# EAGLE design mbmc_io (EAGLE 9.6.2)
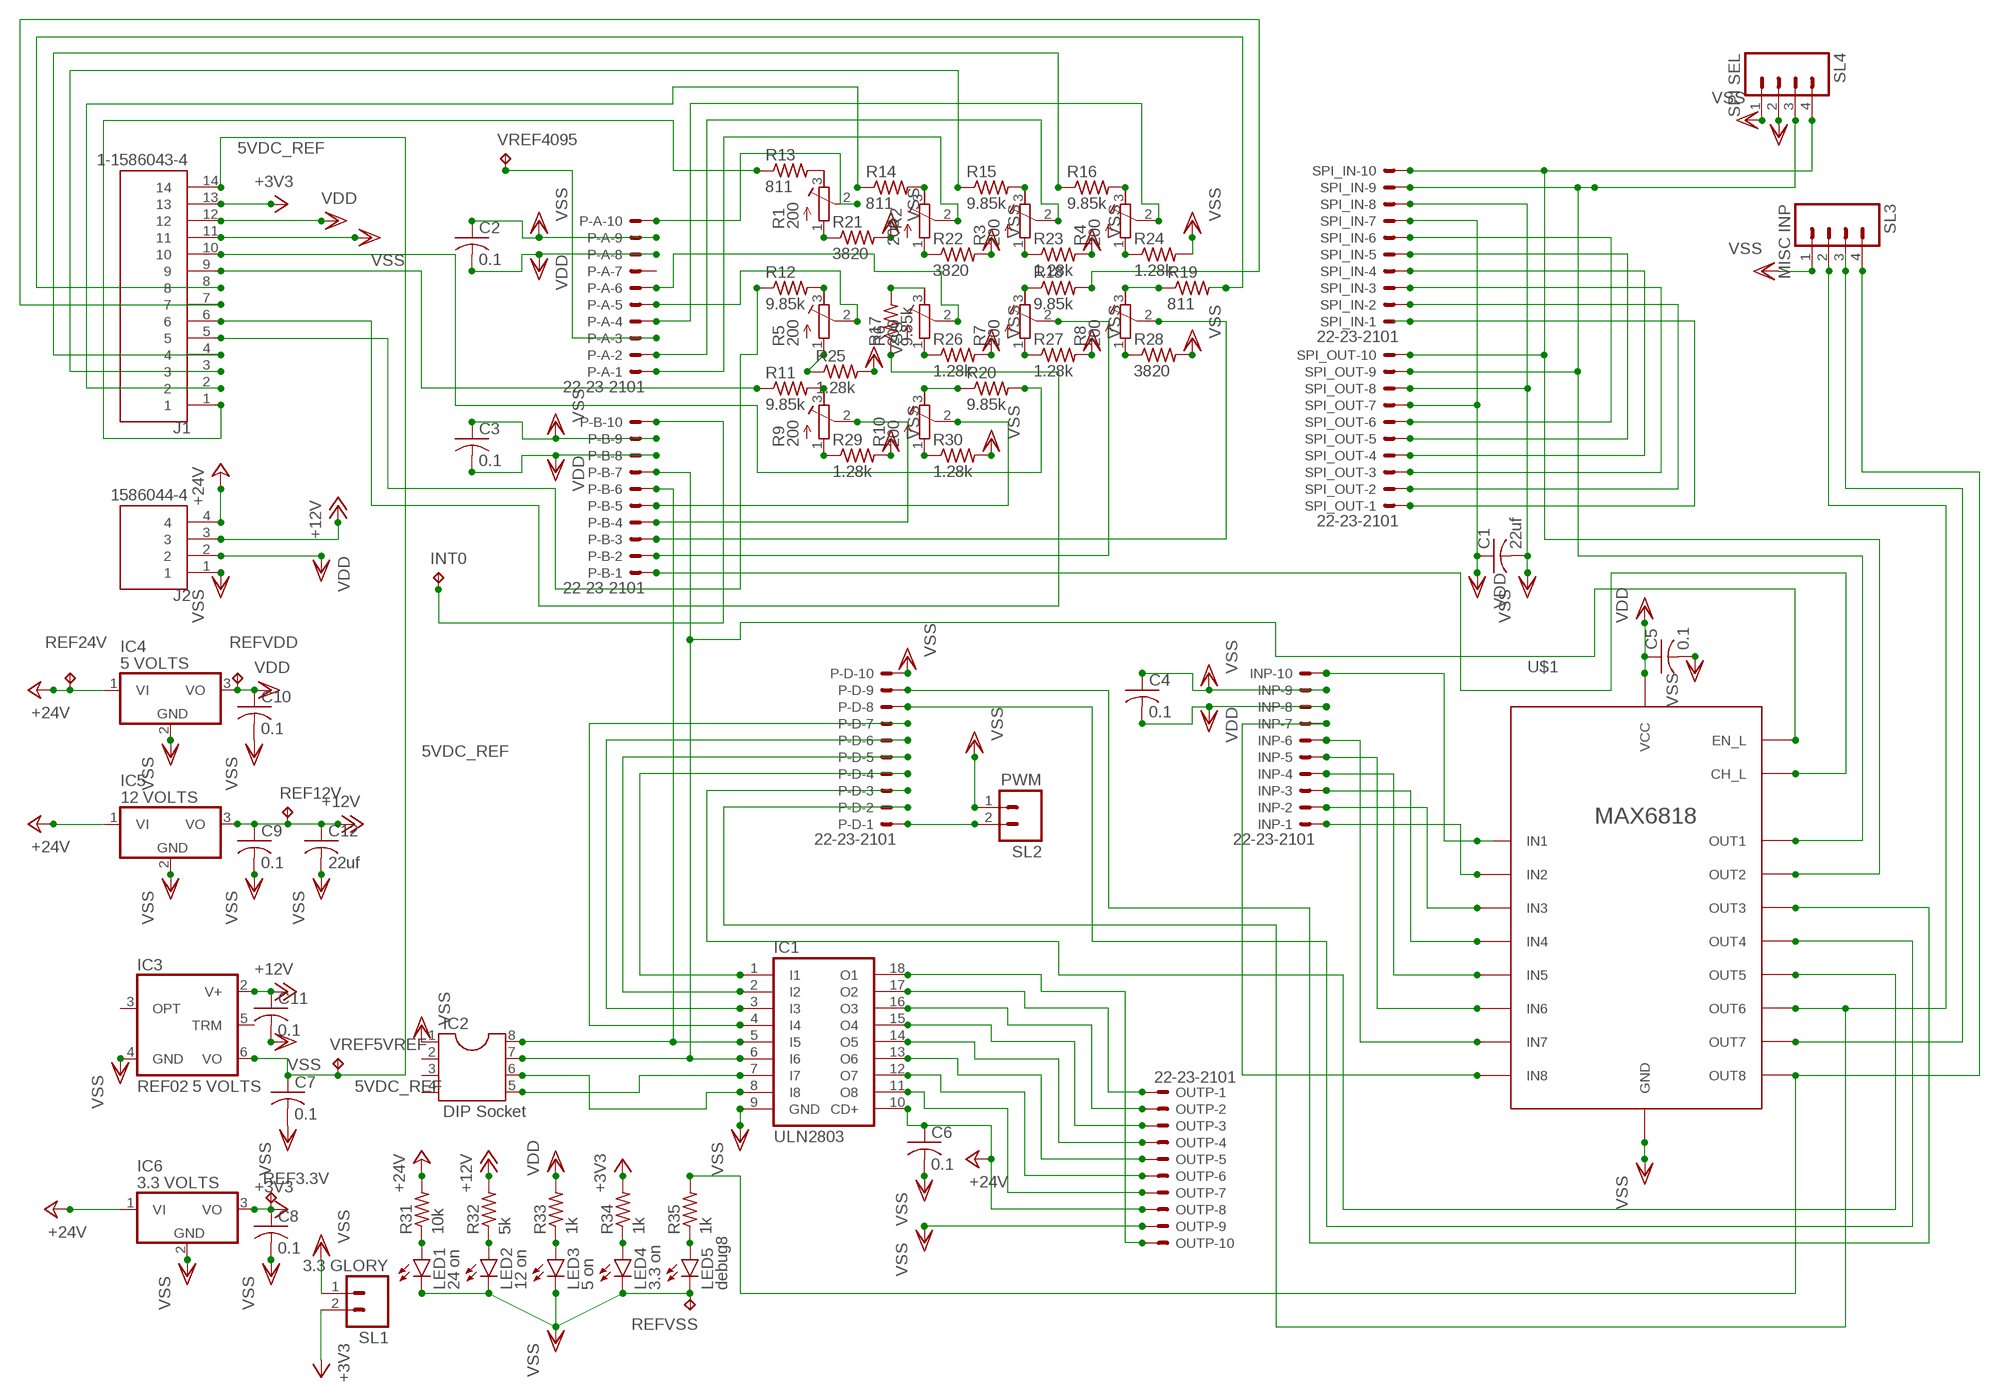
[diagram p0: schematic, sheet 1]

## Parts
C1  22uf  C-USC0805  [C0805]
C2  0.1  C-USC0805  [C0805]
C3  0.1  C-USC0805  [C0805]
C4  0.1  C-USC0805  [C0805]
C5  0.1  C-USC0805  [C0805]
C6  0.1  C-USC0805  [C0805]
C7  0.1  C-USC0805  [C0805]
C8  0.1  C-USC0805  [C0805]
C9  0.1  C-USC0805  [C0805]
C10  0.1  C-USC0805  [C0805]
C11  0.1  C-USC0805  [C0805]
C12  22uf  C-USC0805  [C0805]
IC1  ULN2803  ULN2803A  [DIL18]
IC2  DIP Socket  DIL8S  [SOCKET-08]
IC3  REF02 5 VOLTS  REF02Z  [DIL08]
IC4  5 VOLTS  7805TV  [TO220V]
IC5  12 VOLTS  7805TV  [TO220V]
IC6  3.3 VOLTS  7805TV  [TO220V]
INP  22-23-2101  [22-23-2101]
INT0  TPB1,27  [B1,27]
J1  1-1586043-4  [TE_1-1586043-4]
J2  1586044-4  [TE_1586044-4]
LED1  24 on  LEDCHIPLED_1206  [CHIPLED_1206]
LED2  12 on  LEDCHIPLED_1206  [CHIPLED_1206]
LED3  5 on  LEDCHIPLED_1206  [CHIPLED_1206]
LED4  3.3 on  LEDCHIPLED_1206  [CHIPLED_1206]
LED5  debug8  LEDCHIPLED_1206  [CHIPLED_1206]
OUTP  22-23-2101  [22-23-2101]
P-A  22-23-2101  [22-23-2101]
P-B  22-23-2101  [22-23-2101]
P-D  22-23-2101  [22-23-2101]
R1  200  R-TRIMM3339P  [RTRIM3339P]
R2  200  R-TRIMM3339P  [RTRIM3339P]
R3  200  R-TRIMM3339P  [RTRIM3339P]
R4  200  R-TRIMM3339P  [RTRIM3339P]
R5  200  R-TRIMM3339P  [RTRIM3339P]
R6  200  R-TRIMM3339P  [RTRIM3339P]
R7  200  R-TRIMM3339P  [RTRIM3339P]
R8  200  R-TRIMM3339P  [RTRIM3339P]
R9  200  R-TRIMM3339P  [RTRIM3339P]
R10  200  R-TRIMM3339P  [RTRIM3339P]
R11  9.85k  R-US_R0805  [R0805]
R12  9.85k  R-US_R0805  [R0805]
R13  811  R-US_R0805  [R0805]
R14  811  R-US_R0805  [R0805]
R15  9.85k  R-US_R0805  [R0805]
R16  9.85k  R-US_R0805  [R0805]
R17  9.85k  R-US_R0805  [R0805]
R18  9.85k  R-US_R0805  [R0805]
R19  811  R-US_R0805  [R0805]
R20  9.85k  R-US_R0805  [R0805]
R21  3820  R-US_R0805  [R0805]
R22  3820  R-US_R0805  [R0805]
R23  1.28k  R-US_R0805  [R0805]
R24  1.28k  R-US_R0805  [R0805]
R25  1.28k  R-US_R0805  [R0805]
R26  1.28k  R-US_R0805  [R0805]
R27  1.28k  R-US_R0805  [R0805]
R28  3820  R-US_R0805  [R0805]
R29  1.28k  R-US_R0805  [R0805]
R30  1.28k  R-US_R0805  [R0805]
R31  10k  R-US_R0805  [R0805]
R32  5k  R-US_R0805  [R0805]
R33  1k  R-US_R0805  [R0805]
R34  1k  R-US_R0805  [R0805]
R35  1k  R-US_R0805  [R0805]
REF3.3V  TPB1,27  [B1,27]
REF12V  TPB1,27  [B1,27]
REF24V  TPB1,27  [B1,27]
REFVDD  TPB1,27  [B1,27]
REFVSS  TPB1,27  [B1,27]
SL1  3.3 GLORY  M02  [02P]
SL2  PWM  M02  [02P]
SL3  MISC INP  M04  [04P]
SL4  SPI SEL  M04  [04P]
SPI_IN  22-23-2101  [22-23-2101]
SPI_OUT  22-23-2101  [22-23-2101]
U$1  MAX6818  [SSOP20]
VREF5VREF  TPB1,27  [B1,27]
VREF4095  TPB1,27  [B1,27]

## Nets
5VDC_REF: C7.1 IC3.6(VO) J1.14 VREF5VREF.TP
+3V3 [i-lines]: C8.1 IC6.3(VO) J1.13 R34.2 REF3.3V.TP SL1.2
+12V [i-lines]: C9.1 C11.1 C12.1 IC3.2(V+) IC5.3(VO) J2.3 R32.2 REF12V.TP
+24V [i-lines]: C6.1 IC1.10(CD+) IC4.1(VI) IC5.1(VI) IC6.1(VI) J2.4 OUTP.8 R31.2 REF24V.TP
N$1: R9.3(E) R11.2
N$2: R5.3(E) R12.2
N$3: R1.3(E) R13.2
N$4: R2.3(E) R14.2
N$5: R3.3(E) R15.2
N$6: R4.3(E) R16.2
N$7: R6.3(E) R17.2
N$8: J1.7 R18.2
N$9: R8.3(E) R19.1
N$10: J1.8 R19.2
N$11: R1.1(A) R21.1
N$12: R2.1(A) R22.1
N$13: R3.1(A) R23.1
N$14: R4.1(A) R24.1
N$15: R5.1(A) R25.1
N$16: R6.1(A) R26.1
N$17: R7.1(A) R27.1
N$18: R8.1(A) R28.1
N$19: R9.1(A) R29.1
N$20: R10.1(A) R30.1
N$21: P-A.10 R1.2(S)
N$22: P-A.1 R2.2(S)
N$23: P-A.2 R3.2(S)
N$24: J1.2 R14.1
N$25: P-A.5 R5.2(S)
N$26: P-A.6 R6.2(S)
N$27: P-B.2 R7.2(S)
N$28: P-B.3 R8.2(S)
N$29: P-B.4 R9.2(S)
N$30: P-B.5 R10.2(S)
N$31: IC1.1(I1) P-D.4
N$32: IC1.2(I2) P-D.5
N$33: IC1.3(I3) P-D.6
N$34: IC1.4(I4) P-D.7
N$35: IC1.5(I5) IC2.8 P-B.6
N$36: IC1.6(I6) IC2.7 P-B.7 U$1.EN_L
N$37: IC1.7(I7) IC2.5
N$38: IC1.8(I8) IC2.6
N$39: SL4.3 SPI_IN.9 SPI_OUT.9 U$1.OUT1
N$40: P-B.1 U$1.CH_L
N$41: P-D.9 U$1.OUT3
N$42: P-D.8 U$1.OUT4
N$43: P-D.3 U$1.OUT5
N$44: INP.10 U$1.IN1
N$45: SL4.4 SPI_IN.10 SPI_OUT.10 U$1.OUT2
N$46: INP.1 U$1.IN2
N$47: INP.2 U$1.IN3
N$48: INP.3 U$1.IN4
N$49: INP.4 U$1.IN5
N$50: INP.5 U$1.IN6
N$51: INP.6 U$1.IN7
N$52: INP.7 U$1.IN8
N$53: IC1.18(O1) OUTP.10
N$54: IC1.17(O2) OUTP.1
N$55: IC1.16(O3) OUTP.2
N$56: IC1.15(O4) OUTP.3
N$57: IC1.14(O5) OUTP.4
N$58: IC1.13(O6) OUTP.5
N$59: IC1.12(O7) OUTP.6
N$60: IC1.11(O8) OUTP.7
N$62: SPI_IN.6 SPI_OUT.6
N$63: SPI_IN.5 SPI_OUT.5
N$64: SPI_IN.4 SPI_OUT.4
N$65: SPI_IN.3 SPI_OUT.3
N$66: SPI_IN.2 SPI_OUT.2
N$67: SPI_IN.1 SPI_OUT.1
N$68: J1.4 R16.1
N$69: J1.9 R11.1
N$70: J1.3 R15.1
N$71: J1.10 R20.2
N$72: J1.5 R12.1
N$73: J1.6 R17.1
N$74: J1.1 R13.1
N$75: P-A.4 R4.2(S)
N$76: LED1.A R31.1
N$77: LED2.A R32.1
N$78: LED3.A R33.1
N$79: LED4.A R34.1
N$80: LED5.A R35.1
N$81: R35.2 SL3.4 U$1.OUT8
N$82: P-D.1 SL2.2
N$83: R10.3(E) R20.1
N$84: SL3.3 U$1.OUT7
N$85: P-A.3 VREF4095.TP
N$86: P-D.2 SL3.2 U$1.OUT6
N$87: INT0.TP P-B.10
N$88: R7.3(E) R18.1
VDD [i-lines]: C1.1 C2.2 C3.2 C4.2 C5.1 C10.1 IC4.3(VO) INP.8 J1.12 J2.2 P-A.8 P-B.8 R33.2 REFVDD.TP SL4.2 SPI_IN.7 SPI_OUT.7 U$1.VCC
VSS [i-lines]: C1.2 C2.1 C3.1 C4.1 C5.2 C6.2 C7.2 C8.2 C9.2 C10.2 C11.2 C12.2 IC1.9(GND) IC2.1 IC3.4(GND) IC4.2(GND) IC5.2(GND) IC6.2(GND) INP.9 J1.11 J2.1 LED1.C LED2.C LED3.C LED4.C LED5.C OUTP.9 P-A.9 P-B.9 P-D.10 R21.2 R22.2 R23.2 R24.2 R25.2 R26.2 R27.2 R28.2 R29.2 R30.2 REFVSS.TP SL1.1 SL2.1 SL3.1 SL4.1 SPI_IN.8 SPI_OUT.8 U$1.GND
Unconnected: IC2.2 IC2.3 IC2.4 IC3.3(OPT) IC3.5(TRM) P-A.7

## Library data of the parts
C1-C12 = rcl:C-US: CAPACITOR, American symbol; SPICEPREFIX: C
IC1 = uln-udn:ULN2803A: DRIVER ARRAY
IC2 = ic-package:DIL8: Dual In Line / Socket
IC3 = linear:REF02: VOLTAGE REFERENCE
IC4-IC6 = linear:78*: Positive VOLTAGE REGULATOR Source: http://cache.national.com/ds/LM/LM78L05.pdf http://www.fairchildsemi.com/ds/LM/LM7805.pdf
INP OUTP P-A P-B P-D SPI_IN SPI_OUT = con-molex:22-23-2101: .100" (2.54mm) Center Header - 10 Pin; MF: MOLEX; MPN: 22-23-2101; OC_FARNELL: 1756828; OC_NEWARK: 94C0765
INT0 REF3.3V REF12V REF24V REFVDD REFVSS VREF5VREF VREF4095 = testpad:TP: Test pad
J1 = 1-1586043-4:1-1586043-4; MANUFACTURER: TE; PARTREV: R; STANDARD: Manufacturer Recommendations
J2 = 1586044-4:1586044-4; MANUFACTURER: TE; PARTREV: R; STANDARD: Manufacturer Recommendations
LED1-LED5 = led:LED: LED OSRAM: - CHIPLED LG R971, LG N971, LY N971, LG Q971, LY Q971, LO R971, LY R971 LH N974, LH R974 LS Q976, LO Q976, LY Q976 LO Q996 - Hyper CHIPLED LW Q18S LB Q993, LB Q99A, LB R99A - SideLED LS A670, LO A670, LY A670, LG A670, LP A670 LB A673, LV A673, LT A673, LW A673 LH A674 LY A675 LS A676, LA A676, LO A676, LY A676, LW A676 LS A679, LY A679, LG A679 - Hyper Micro SIDELED® LS Y876, LA Y876, LO Y876, LY Y876 LT Y87S - SmartLED LW L88C, LW L88S LB L89C, LB L89S, LG L890 LS L89K, LO L89K, LY L89K LS L896, LA L896, LO L896, LY L896 - TOPLED LS T670, LO T670, LY T670, LG T670, LP T670 LSG T670, LSP T670, LSY T670, LOP T670, LYG T670 LG T671, LOG T671, LSG T671 LB T673, LV T673, LT T673, LW T673 LH T674 LS T676, LA T676, LO T676, LY T676, LB T676, LH T676, LSB T676, LW T676 LB T67C, LV T67C, LT T67C, LS T67K, LO T67K, LY T67K, LW E67C LS E67B, LA E67B, LO E67B, LY E67B, LB E67C, LV E67C, LT E67C LW T67C LS T679, LY T679, LG T679 LS T770, LO T770, LY T770, LG T770, LP T770 LB T773, LV T773, LT T773, LW T773 LH T774 LS E675, LA E675, LY E675, LS T675 LS T776, LA T776, LO T776, LY T776, LB T776 LHGB T686 LT T68C, LB T68C - Hyper Mini TOPLED® LB M676 - Mini TOPLED Santana® LG M470 LS M47K, LO M47K, LY M47K Source: http://www.osram.convergy.de LUXEON: - LUMILED® LXK2-PW12-R00, LXK2-PW12-S00, LXK2-PW14-U00, LXK2-PW14-V00 LXK2-PM12-R00, LXK2-PM12-S00, LXK2-PM14-U00 LXK2-PE12-Q00, LXK2-PE12-R00, LXK2-PE12-S00, LXK2-PE14-T00, LXK2-PE14-U00 LXK2-PB12-K00, LXK2-PB12-L00, LXK2-PB12-M00, LXK2-PB14-N00, LXK2-PB14-P00, LXK2-PB14-Q00 LXK2-PR12-L00, LXK2-PR12-M00, LXK2-PR14-Q00, LXK2-PR14-R00 LXK2-PD12-Q00, LXK2-PD12-R00, LXK2-PD12-S00 LXK2-PH12-R00, LXK2-PH12-S00 LXK2-PL12-P00, LXK2-PL12-Q00, LXK2-PL12-R00 Source: www.luxeon.com KINGBRIGHT: KA-3528ASYC Source: www.kingbright.com
R1-R10 = rcl:R-TRIMM: Trimm resistor; SPICEMODEL: X; SPICEPREFIXL: POT
R11-R35 = rcl:R-US_: RESISTOR, American symbol; SPICEPREFIX: R
SL1 SL2 = con-amp-quick:M02: AMP QUICK CONNECTOR; OC_FARNELL: unknown; OC_NEWARK: unknown
SL3 SL4 = con-amp-quick:M04: AMP QUICK CONNECTOR; OC_FARNELL: unknown; OC_NEWARK: unknown
U$1 = MAX6818:MAX6818; AVAILABILITY: Unavailable; MF: Maxim Integrated; MP: MAX6818; PACKAGE: None; PRICE: None

## Net classes
1 i-lines: width 0.4 mm

## Board
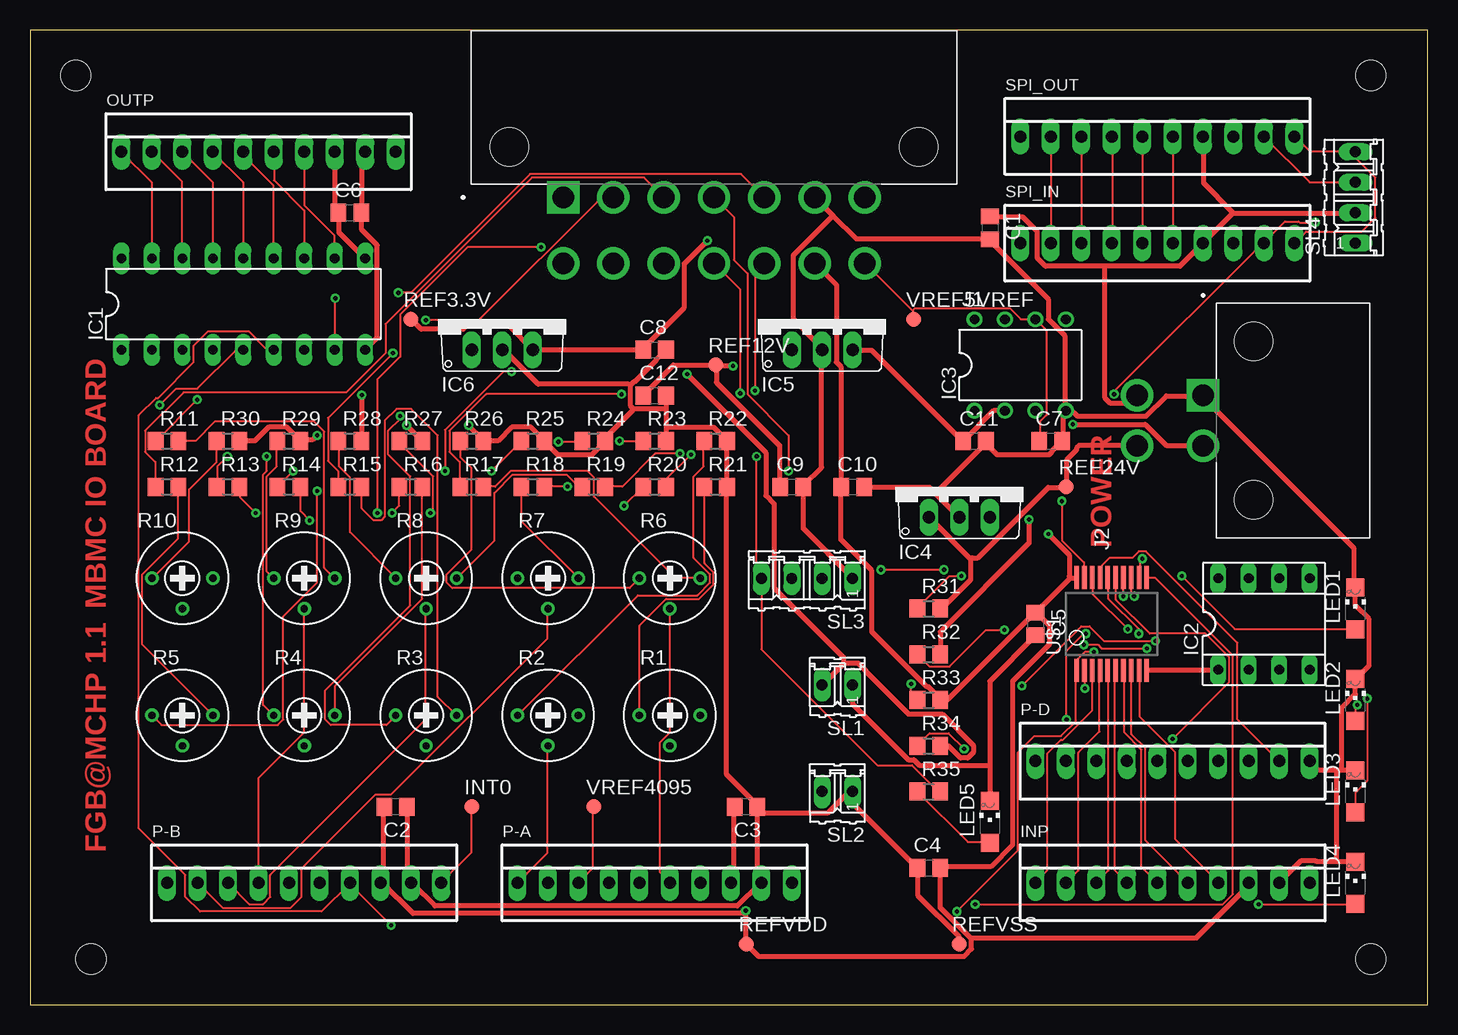
[diagram p1: board, top side]
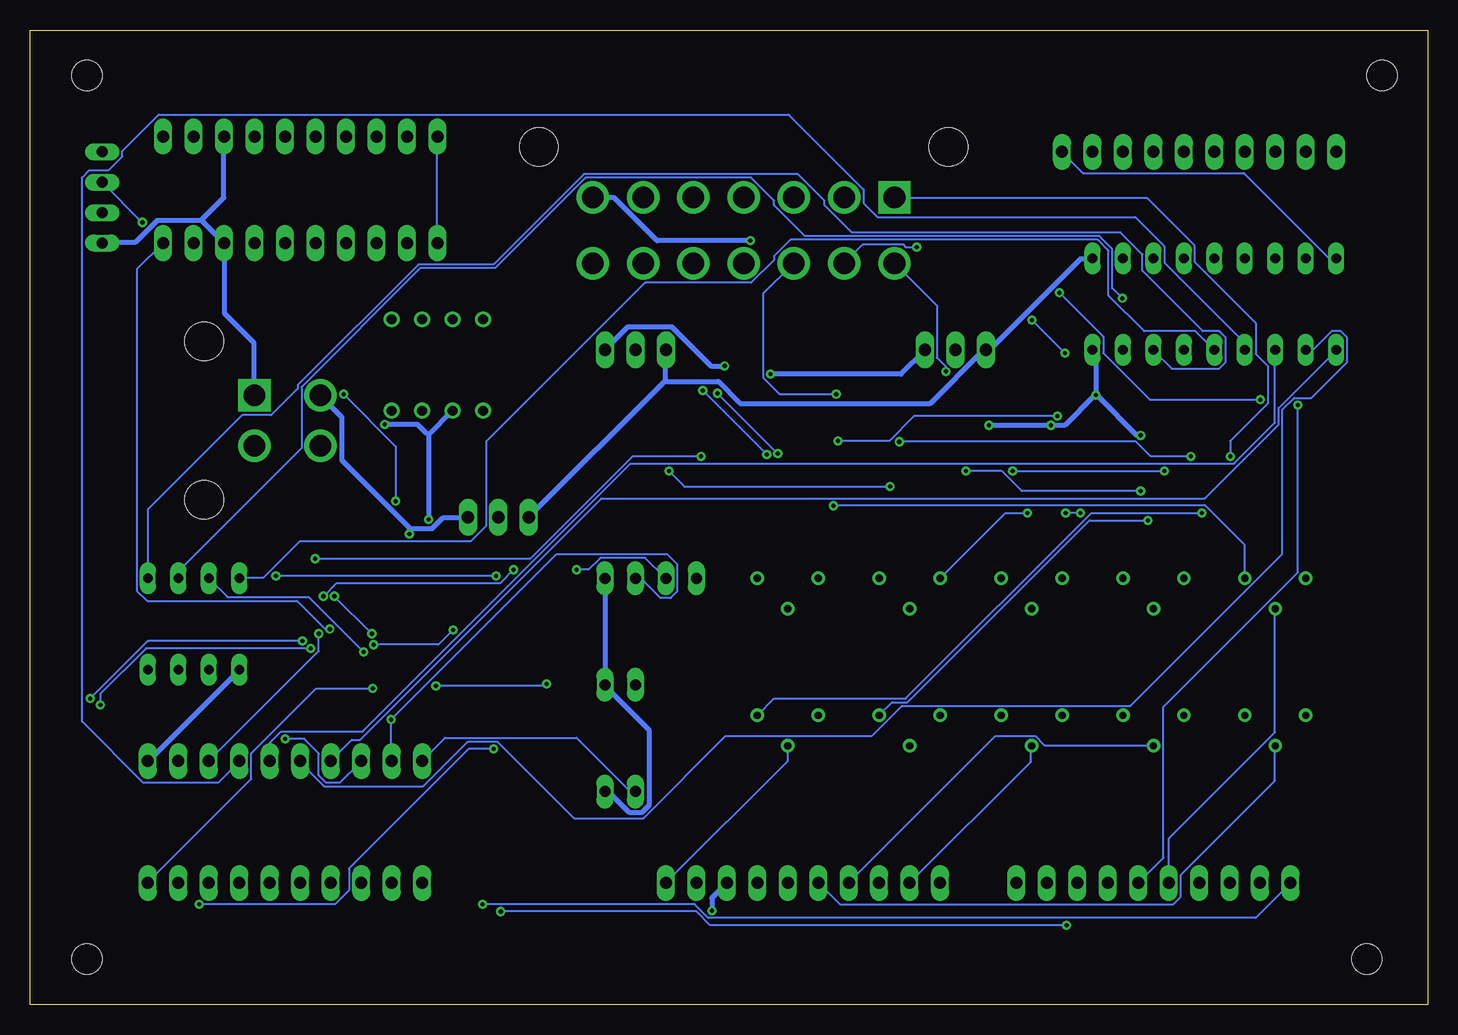
[diagram p2: board, bottom side, seen from below]

Size 116.51 x 81.27 mm. Coordinates in mm from the lower left corner, seen from the top.
Outline: 0,0 116.51,0 116.51,81.27 0,81.27 0,0
Copper layers (1*16): Top 0.035mm / dielectric 1.5mm / Bottom 0.035mm
Design rules "default": minimum track width 6mil, minimum drill 0.35mm, track to track 6mil, track to pad 6mil, pad to pad 6mil, via to via 6mil, smd to smd 6mil, copper to edge 40mil, drill to drill 6mil, minimum pad ring 10mil, minimum via ring 8mil, stop-mask expansion 4mil, vias tented up to drill 0mil, thermal gap 10mil
Holes 2.5 mm at 5.08,3.81 111.76,3.81 111.76,77.47 3.81,77.47

### Footprints (pad centres in the part's own frame; a part is rotated, then mirrored left to right if it is on the bottom)
C0805 = smd 1.3 x 1.5: 1 -0.95,0; 2 0.95,0
DIL18 = drill 0.813 long: 1 -10.16,-3.81; 2 -7.62,-3.81; 3 -5.08,-3.81; 4 -2.54,-3.81; 5 0,-3.81; 6 2.54,-3.81; 7 5.08,-3.81; 8 7.62,-3.81; 9 10.16,-3.81; 10 10.16,3.81; 11 7.62,3.81; 12 5.08,3.81; 13 2.54,3.81; 14 0,3.81; 15 -2.54,3.81; 16 -5.08,3.81; 17 -7.62,3.81; 18 -10.16,3.81
SOCKET-08 = drill 0.813 long: 1 -3.81,-3.81; 2 -1.27,-3.81; 3 1.27,-3.81; 4 3.81,-3.81; 5 3.81,3.81; 6 1.27,3.81; 7 -1.27,3.81; 8 -3.81,3.81
DIL08 = drill 0.813 pad 1.27: 1 -3.81,-3.81; 2 -1.27,-3.81; 3 1.27,-3.81; 4 3.81,-3.81; 5 3.81,3.81; 6 1.27,3.81; 7 -1.27,3.81; 8 -3.81,3.81
TO220V = drill 1.016 long: 1 -2.54,-2.54; 2 0,-2.54; 3 2.54,-2.54
22-23-2101 = drill 1 long: 1 -11.43,0; 2 -8.89,0; 3 -6.35,0; 4 -3.81,0; 5 -1.27,0; 6 1.27,0; 7 3.81,0; 8 6.35,0; 9 8.89,0; 10 11.43,0
B1,27 = smd 1.27 x 1.27: TP 0,0
TE_1-1586043-4 = drill 1.8 pad 2.15 square: 1 0,0 | drill 1.8 pad 2.15: 2 0,5.5; 3 -4.19,0; 4 -4.19,5.5; 5 -8.38,0; 6 -8.38,5.5; 7 -12.57,0; 8 -12.57,5.5; 9 -16.76,0; 10 -16.76,5.5; 11 -20.95,0; 12 -20.95,5.5; 13 -25.14,0; 14 -25.14,5.5 | hole 3.2: -29.64,-4.2; 4.5,-4.2
TE_1586044-4 = drill 1.8 pad 2.15 square: 1 0,0 | drill 1.8 pad 2.15: 2 0,5.5; 3 -4.19,0; 4 -4.19,5.5 | hole 3.2: -8.69,-4.2; 4.5,-4.2
CHIPLED_1206 = smd 1.5 x 1.5: A 0,-1.75; C 0,1.75
RTRIM3339P = drill 0.61: 1 -2.54,0; 2 0,-2.54; 3 2.54,0
R0805 = smd 1.3 x 1.5: 1 -0.95,0; 2 0.95,0
02P = drill 0.914 long: 1 -1.27,0; 2 1.27,0
04P = drill 0.914 long: 1 -3.81,0; 2 -1.27,0; 3 1.27,0; 4 3.81,0
SSOP20 = smd 0.381 x 1.93: CH_L 2.925,3.879; EN_L -2.925,-3.879; GND 2.925,-3.879; IN1 -2.275,-3.879; IN2 -1.625,-3.879; IN3 -0.975,-3.879; IN4 -0.325,-3.879; IN5 0.325,-3.879; IN6 0.975,-3.879; IN7 1.625,-3.879; IN8 2.275,-3.879; OUT1 -2.275,3.879; OUT2 -1.625,3.879; OUT3 -0.975,3.879; OUT4 -0.325,3.879; OUT5 0.325,3.879; OUT6 0.975,3.879; OUT7 1.625,3.879; OUT8 2.275,3.879; VCC -2.917,3.868

### Placement (x,y rotation side)
C1  80.01,64.77 270 top
C2  30.48,16.51 180 top
C3  59.69,16.51 180 top
C4  74.93,11.43 0 top
C5  83.82,31.75 270 top
C6  26.67,66.04 0 top
C7  85.09,46.99 0 top
C8  52.07,54.61 0 top
C9  63.5,43.18 0 top
C10  68.58,43.18 0 top
C11  78.74,46.99 0 top
C12  52.07,50.8 0 top
IC1  17.78,58.42 0 top
IC2  102.87,31.75 0 top
IC3  82.55,53.34 0 top
IC4  77.47,43.18 0 top
IC5  66.04,57.15 0 top
IC6  39.37,57.15 0 top
INP  95.25,10.16 0 top
INT0  36.83,16.51 0 top
J1  44.45,67.31 180 top
J2  97.79,50.8 90 top
LED1  110.49,33.02 0 top
LED2  110.49,25.4 0 top
LED3  110.49,17.78 0 top
LED4  110.49,10.16 0 top
LED5  80.01,15.24 0 top
OUTP  19.05,71.12 0 top
P-A  52.07,10.16 0 top
P-B  22.86,10.16 0 top
P-D  95.25,20.32 0 top
R1  53.34,24.13 0 top
R2  43.18,24.13 0 top
R3  33.02,24.13 0 top
R4  22.86,24.13 0 top
R5  12.7,24.13 0 top
R6  53.34,35.56 0 top
R7  43.18,35.56 0 top
R8  33.02,35.56 0 top
R9  22.86,35.56 0 top
R10  12.7,35.56 0 top
R11  11.43,46.99 0 top
R12  11.43,43.18 0 top
R13  16.51,43.18 0 top
R14  21.59,43.18 0 top
R15  26.67,43.18 0 top
R16  31.75,43.18 0 top
R17  36.83,43.18 0 top
R18  41.91,43.18 0 top
R19  46.99,43.18 0 top
R20  52.07,43.18 0 top
R21  57.15,43.18 0 top
R22  57.15,46.99 0 top
R23  52.07,46.99 0 top
R24  46.99,46.99 0 top
R25  41.91,46.99 0 top
R26  36.83,46.99 0 top
R27  31.75,46.99 0 top
R28  26.67,46.99 0 top
R29  21.59,46.99 0 top
R30  16.51,46.99 0 top
R31  74.93,33.02 0 top
R32  74.93,29.21 0 top
R33  74.93,25.4 0 top
R34  74.93,21.59 0 top
R35  74.93,17.78 0 top
REF3.3V  31.75,57.15 0 top
REF12V  57.15,53.34 0 top
REF24V  86.36,43.18 0 top
REFVDD  59.69,5.08 0 top
REFVSS  77.47,5.08 0 top
SL1  67.31,26.67 180 top
SL2  67.31,17.78 180 top
SL3  64.77,35.56 180 top
SL4  110.49,67.31 90 top
SPI_IN  93.98,63.5 0 top
SPI_OUT  93.98,72.39 0 top
U$1  90.17,31.75 0 top
VREF5VREF  73.66,57.15 0 top
VREF4095  46.99,16.51 0 top

### Tracks (layer width: path | path; a pad name or v marks a point on that pad's centre or on a via)
5VDC_REF
  Top 0.152: C7.1 84.2,47.02 84.2,48.62 84.73,49.15 84.73,56.24 IC3.6 82.6,57.15 81.69,58.06 73.76,58.06 73.57,57.87 | 73.57,57.87 69.65,61.8 J1.14 | 73.57,57.87 73.61,57.84 73.61,57.15 VREF5VREF.TP
+3V3  (via drill 0.35)
  Top 0.4: 67.89,28.5 69.04,28.5 69.65,27.89 69.65,27.81 73.23,24.23 76.05,24.23 78.64,21.64 78.64,21.03 78.18,20.57 77.57,20.57 76.58,21.57 75.89,21.57 R34.2 | 67.89,28.5 66.06,26.67 SL1.2 | REF3.3V.TP 31.77,57.15 32.61,56.31 36.12,56.31 36.35,56.54 40.01,56.54 41.91,54.63 IC6.3 42.06,54.63 51.05,54.63 C8.1 51.21,54.79 54.56,58.14 54.56,61.8 v56.46,63.7 | v54.79,52.58 61.34,46.02 61.34,42.44 62.03,41.76 62.03,34.75 67.82,28.96 67.82,28.65 67.89,28.5
  Bottom 0.4: v56.46,63.7 64.24,63.7 67.82,67.28 69.57,67.28 J1.13 | v54.79,52.58 43.89,52.58 41.91,54.56 IC6.3
+12V  (via drill 0.35)
  Top 0.4: REF12V.TP 53.65,53.34 51.13,50.83 C12.1 | C9.1 62.48,43.2 62.48,46.63 57.23,51.89 57.23,53.19 REF12V.TP | v83.29,40.46 83.29,38.48 75.89,31.09 75.89,29.26 R32.2 | IC3.2 80.31,49.53 77.8,47.02 C11.1 77.65,47.09 70.18,54.56 68.58,54.56 IC5.3 | v86.94,48.39 92.96,48.39 94.72,46.63 97.77,46.63 J2.3 | v58.6,53.26 57.38,53.26 REF12V.TP
  Bottom 0.4: 83.29,47.55 v83.29,40.46 | 83.29,47.55 81.31,49.53 IC3.2 | v86.94,48.39 84.2,48.39 83.44,47.62 83.29,47.55 | v58.6,53.26 59.74,53.26 63.02,56.54 66.67,56.54 68.58,54.63 IC5.3
+24V
  Top 0.4: IC1.10 27.89,62.26 25.76,64.39 25.76,65.99 C6.1 25.68,66.22 25.45,66.45 25.45,71.09 OUTP.8 | J2.4 92.28,46.63 87.48,46.63 87.25,46.41 87.25,46.25 86.41,45.41 86.41,43.2 REF24V.TP 86.18,43.13 84.89,43.13 79.02,37.26 78.56,37.26 78.41,37.19 | 78.41,37.19 78.41,35.43 76.05,33.07 75.89,33.07 R31.2 | 78.41,37.19 74.98,40.62 IC4.1
  Bottom 0.4: IC1.10 27.96,62.18 28.96,62.18 36.5,54.63 36.8,54.63 IC6.1 36.96,54.48 37.11,54.48 41.45,50.14 57.3,50.14 59.13,51.97 63.4,51.97 63.55,52.05 | 63.55,52.05 63.55,54.56 IC5.1 | 63.55,52.05 74.91,40.69 IC4.1
N$1
  Top 0.152: R9.3 24.54,36.42 24.54,47.78 23.7,48.62 15.39,48.62 13.79,47.02 12.42,47.02 R11.2
N$2
  Top 0.152: R12.2 12.34,43.13 12.34,38.86 9.37,35.89 9.37,30.02 15.24,24.16 R5.3
N$3  (via drill 0.35)
  Top 0.152: v18.82,41 17.53,42.29 17.53,43.13 R13.2
  Bottom 0.152: v18.82,41 28.04,41 43.51,25.53 54.48,25.53 R1.3
N$4  (via drill 0.35)
  Top 0.152: v23.32,40.39 22.55,41.15 22.55,43.13 R14.2
  Bottom 0.152: v23.32,40.39 28.19,40.39 43.36,25.22 44.65,25.22 45.72,24.16 R2.3
N$5
  Top 0.152: R15.2 27.66,43.13 27.66,41.38 28.65,40.39 29.26,40.39 29.57,40.69 29.57,48.69 30.56,49.68 31.77,49.68 33.98,47.47 33.98,25.68 35.51,24.16 R3.3
N$6
  Top 0.152: R16.2 32.69,43.13 32.69,33.83 25.45,26.59 25.45,24.16 R4.3
N$7
  Top 0.152: R17.2 37.8,43.2 38.79,43.2 40.08,44.5 46.48,44.5 47.02,43.97 47.02,42.37 53.8,35.59 55.85,35.59 R6.3
N$8  (via drill 0.35)
  Top 0.152: v44.81,43.2 42.9,43.2 R18.2 | v63.25,44.5 63.25,47.47 59.82,50.9 59.82,60.96 58.67,62.1 58.67,65.68 57.07,67.28 J1.7
  Bottom 0.152: v44.81,43.2 61.95,43.2 v63.25,44.5
N$9
  Top 0.152: R8.3 38.71,38.71 38.71,42.67 40.23,44.2 44.73,44.2 45.72,43.2 46.02,43.2 R19.1
N$10  (via drill 0.35)
  Top 0.152: v54.18,45.95 52.12,45.95 49.38,43.2 48.01,43.2 R19.2 | v59.21,50.98 59.21,59.66 57.07,61.8 J1.8
  Bottom 0.152: v59.21,50.98 v54.18,45.95
N$11
  Top 0.152: R21.1 56.24,43.13 56.24,36.8 57,36.04 57,35.05 55.78,33.83 53.03,33.83 50.83,31.62 50.83,24.16 R1.1
N$12
  Top 0.152: R22.1 56.16,46.94 56.16,44.88 55.32,44.04 55.32,37.26 56.69,35.89 56.69,35.2 55.63,34.14 50.67,34.14 40.69,24.16 R2.1
N$13  (via drill 0.35)
  Top 0.152: v49.15,47.02 51.05,47.02 R23.1 | v30.86,49.07 30.86,48.84 29.87,47.85 29.87,45.87 31.7,44.04 31.7,33.3 24.61,26.21 24.61,23.77 25.07,23.32 29.72,23.32 30.48,24.08 R3.1
  Bottom 0.152: v49.15,47.02 44.88,47.02 42.82,49.07 v30.86,49.07
N$14  (via drill 0.35)
  Top 0.152: v44.04,46.94 46.02,46.94 R24.1 | v19.74,45.72 19.74,44.5 19.43,44.2 19.43,24.99 20.27,24.16 R4.1
  Bottom 0.152: v44.04,46.94 24.31,46.94 23.09,45.72 v19.74,45.72
N$15  (via drill 0.35)
  Top 0.152: v38.48,44.5 40.92,46.94 R25.1 | v23.93,42.82 23.93,35.2 21.11,32.38 21.11,23.77 20.65,23.32 10.97,23.32 R5.1
  Bottom 0.152: v38.48,44.5 35.51,44.5 33.83,42.82 v23.93,42.82
N$16
  Top 0.152: R6.1 49.99,34.75 35.2,34.75 34.75,35.2 34.75,35.89 36.8,37.95 36.8,44.73 35.89,45.64 35.89,46.94 R26.1
N$17  (via drill 0.35)
  Top 0.152: v33.38,41 33.6,41.22 33.6,44.04 30.86,46.79 30.86,46.94 R27.1
  Bottom 0.152: v33.38,41 35.2,41 R7.1
N$18
  Top 0.152: R28.1 25.76,46.94 25.76,44.88 26.67,43.97 26.67,39.4 30.48,35.59 R8.1
N$19
  Top 0.152: R29.1 20.57,46.94 20.57,44.88 19.74,44.04 19.74,36.12 20.27,35.59 R9.1
N$20
  Top 0.152: R30.1 15.54,46.94 15.54,45.26 13.26,42.98 13.26,38.63 10.21,35.59 R10.1
N$21
  Bottom 0.152: R1.2 53.34,20.34 63.48,10.21 P-A.10
N$22
  Top 0.152: P-A.1 43.13,12.65 43.13,21.57 R2.2
N$23
  Bottom 0.152: P-A.2 33.07,20.27 33.07,21.57 R3.2
N$24  (via drill 0.35)
  Top 0.152: v21.95,44.5 20.65,43.2 R14.1 | v34.59,44.5 34.59,47.93 39.47,52.81 v40.16,52.81
  Bottom 0.152: v34.59,44.5 v21.95,44.5 | v40.16,52.81 40.16,53.19 40.92,53.95 40.92,58.29 44.42,61.8 J1.2
N$25
  Bottom 0.152: R5.2 12.72,21.57 12.72,18.67 20.57,10.82 20.57,8.99 21.18,8.38 49,8.38 50.75,10.13 P-A.5
N$26
  Top 0.152: R6.2 53.34,22.71 52.5,21.87 52.5,11.05 53.34,10.21 P-A.6
N$27
  Top 0.152: R7.2 43.13,32.99 43.13,30.56 30.1,17.53 28.8,17.53 22.63,11.35 22.63,8.99 21.72,8.08 16.08,8.08 14.02,10.13 P-B.2
N$28
  Top 0.152: P-B.3 18.29,8.38 19.43,8.38 20.04,8.99 20.04,10.82 32.99,23.77 32.99,32.99 R8.2
N$29
  Top 0.152: R9.2 22.86,22.71 19.05,18.9 P-B.4
N$30
  Bottom 0.152: R10.2 12.72,32.99 12.72,22.71 21.57,13.87 21.57,10.21 P-B.5
N$31
  Bottom 0.152: IC1.1 7.62,54.56 12.42,49.76 12.42,48.39 18.59,42.22 68.89,42.22 89,22.1 89.69,22.1 91.44,20.34 P-D.4
N$32
  Bottom 0.152: IC1.2 10.13,54.63 9.53,54.63 8,56.16 7.24,56.16 6.71,55.63 6.71,53.57 9.68,50.6 11.12,50.6 12.12,49.61 12.12,37.57 24.77,24.92 43.81,24.92 46.33,22.4 58.52,22.4 65.38,15.54 71.17,15.54 77.57,21.95 80.01,21.95 83.74,18.21 91.97,18.21 94.03,20.27 P-D.5
N$33
  Bottom 0.152: IC1.3 12.72,54.56 12.72,48.54 16.15,45.11 66.45,45.11 88.77,22.78 95.56,22.78 96.47,21.87 96.47,20.34 P-D.6
N$34
  Bottom 0.152: IC1.4 15.24,55.17 21.95,61.87 21.95,63.25 24.38,65.68 45.87,65.68 47.02,66.83 47.02,67.97 53.26,74.22 105.77,74.22 108.81,71.17 108.81,70.71 109.96,69.57 111.56,69.57 112.17,68.96 112.17,23.62 107.06,18.52 100.81,18.52 99.06,20.27 P-D.7
N$35  (via drill 0.35)
  Top 0.152: v10.82,49.99 12.19,51.36 13.95,51.36 17.14,54.56 17.75,54.56 IC1.5
  Bottom 0.152: v10.82,49.99 10.82,36.04 22.02,24.84 22.02,12.27 P-B.6 | IC2.8 99.06,35.59 97.08,35.59 94.03,38.63 79.78,38.63 78.49,39.93 78.49,46.94 65.23,60.2 56.39,60.2 54.48,62.1 54.48,62.41 53.11,63.78 27.51,63.78 26.59,62.87 26.59,59.13 23.62,56.16 19.36,56.16 17.83,54.63 IC1.5
N$36  (via drill 0.35)
  Top 0.152: v88.7,29.41 87.94,29.41 87.25,28.73 87.25,27.89 U$1.EN_L 87.17,27.81 87.17,23.62 85.95,22.4 83.74,22.4 82.37,21.03 82.37,12.88 v77.27,7.77 | IC1.6 20.27,54.63 19.74,54.63 18.21,56.16 14.86,56.16 13.64,54.94 13.64,53.57 10.67,50.6 10.52,50.6 9.07,49.15 9.07,14.71 12.95,10.82 12.95,8.99 14.17,7.77 24.31,7.77 26.67,10.13 P-B.7 26.67,10.06 v30.1,6.63
  Bottom 0.152: v88.7,29.41 93.27,33.98 100.05,33.98 101.58,35.51 IC2.7 | v77.27,7.77 60.96,7.77 59.82,6.63 v30.1,6.63
N$37
  Bottom 0.152: IC2.5 106.68,41.3 98.83,49.15 96.39,49.15 94.18,51.36 94.18,51.66 84.12,61.72 77.88,61.72 70.33,69.27 52.5,69.27 50.29,67.06 50.29,66.67 48.01,64.39 25.6,64.39 23.77,62.56 23.77,61.19 18.75,56.16 17.37,56.16 16.84,55.63 16.84,53.57 17.37,53.03 21.34,53.03 22.86,54.56 IC1.7
N$38  (via drill 0.35)
  Top 0.152: v25.45,58.9 25.45,54.63 IC1.8
  Bottom 0.152: v25.45,58.9 26.29,59.74 26.29,63.02 27.36,64.08 51.89,64.08 54.48,66.67 54.48,67.06 56.39,68.96 70.18,68.96 77.72,61.42 83.97,61.42 93.88,51.51 93.88,46.41 104.09,36.2 104.09,35.59 IC2.6
N$39  (via drill 0.35)
  Top 0.152: SL4.3 106.68,68.58 SPI_OUT.9 | v86.03,41.99 86.03,38.71 87.86,36.88 87.86,35.66 U$1.OUT1 | v90.37,50.9 90.37,51.13 102.72,63.48 102.87,63.48 SPI_IN.9 102.87,63.55 104.62,65.3 105.77,65.3 105.84,65.23 v107.14,65.23
  Bottom 0.152: v86.03,41.99 86.03,46.56 v90.37,50.9 | v107.14,65.23 SL4.3
N$40  (via drill 0.35)
  Top 0.152: v78.79,8.38 99.44,8.38 100.28,9.22 100.28,29.11 93.8,35.59 93.12,35.59 U$1.CH_L
  Bottom 0.152: v78.79,8.38 61.11,8.38 59.97,7.24 14.33,7.24 11.43,10.13 P-B.1
N$41
  Top 0.152: U$1.OUT3 89.23,35.66 89.23,36.5 89.99,37.26 91.9,37.26 92.43,37.8 93.04,37.8 100.66,30.18 100.66,23.77 104.09,20.34 P-D.9
N$42  (via drill 0.35)
  Top 0.152: v92.43,30.94 92.43,31.32 89.92,33.83 89.92,35.59 U$1.OUT4
  Bottom 0.152: v92.43,30.94 92.43,29.49 P-D.8
N$43  (via drill 0.35)
  Top 0.152: v95.25,22.17 99.97,26.9 99.97,28.96 97.99,30.94 93.34,30.94 90.53,33.76 90.53,35.59 U$1.OUT5
  Bottom 0.152: v95.25,22.17 93.65,22.17 92.43,20.95 92.43,19.13 91.82,18.52 90.68,18.52 88.92,20.27 P-D.3
N$44  (via drill 0.35)
  Top 0.152: v87.94,26.36 87.94,27.81 U$1.IN1
  Bottom 0.152: v87.94,26.36 92.66,26.36 98.07,20.95 98.07,18.82 106.68,10.21 INP.10
N$45  (via drill 0.35)
  Top 0.152: SPI_OUT.10 105.46,72.39 106.68,71.17 110.49,71.17 SL4.4 110.49,70.64 112.17,68.96 112.17,65.61 111.02,64.47 106.38,64.47 SPI_IN.10 | v91.52,31.32 88.62,34.21 88.62,35.59 U$1.OUT2
  Bottom 0.152: v91.52,31.32 91.9,31.32 94.26,33.68 106.76,33.68 107.59,34.52 107.59,61.34 105.46,63.48 SPI_IN.10
N$46
  Top 0.152: U$1.IN2 88.54,27.81 88.54,24.54 86.11,22.1 85.95,22.1 84.81,20.95 84.81,11.2 83.82,10.21 INP.1
N$47
  Top 0.152: INP.2 87.4,11.2 87.4,21.03 89.15,22.78 89.15,27.81 U$1.IN3
N$48
  Top 0.152: U$1.IN4 89.92,27.81 89.92,11.2 88.92,10.21 INP.3
N$49
  Top 0.152: U$1.IN5 90.45,27.81 90.45,11.2 91.44,10.21 INP.4
N$50
  Top 0.152: U$1.IN6 91.21,27.81 91.21,22.71 92.66,21.26 92.66,11.51 93.95,10.21 INP.5
N$51
  Top 0.152: INP.6 92.96,13.72 92.96,21.41 91.82,22.55 91.82,27.81 U$1.IN7
N$52
  Top 0.152: U$1.IN8 92.51,27.81 92.51,24 95.48,21.03 95.48,13.79 99.06,10.21 INP.7
N$53
  Bottom 0.152: IC1.18 7.62,62.26 8.23,62.26 15.32,69.34 28.73,69.34 30.48,71.09 OUTP.10
N$54
  Top 0.152: IC1.17 10.13,62.26 10.13,68.58 7.62,71.09 OUTP.1
N$55
  Top 0.152: IC1.16 12.65,62.26 12.65,68.66 10.21,71.09 OUTP.2
N$56
  Top 0.152: IC1.15 15.24,68.58 OUTP.3
N$57
  Top 0.152: IC1.14 17.75,62.26 17.75,68.58 15.24,71.09 OUTP.4
N$58
  Top 0.152: IC1.13 20.27,62.26 20.27,68.35 17.83,70.79 17.83,71.09 OUTP.5
N$59
  Top 0.152: IC1.12 22.86,66.22 20.34,68.73 20.34,71.09 OUTP.6
N$60
  Top 0.152: OUTP.7 22.86,66.67 25.38,64.16 25.38,62.26 IC1.11
N$62
  Top 0.152: SPI_OUT.6 SPI_IN.6
N$63
  Top 0.152: SPI_IN.5 92.73,63.55 92.73,72.39 SPI_OUT.5
N$64
  Top 0.152: SPI_IN.4 90.22,63.55 90.22,72.39 SPI_OUT.4
N$65
  Top 0.152: SPI_OUT.3 SPI_IN.3
N$66
  Top 0.152: SPI_IN.2 85.11,63.55 85.11,72.39 SPI_OUT.2
N$67
  Bottom 0.152: SPI_IN.1 82.6,63.55 82.6,72.39 SPI_OUT.1
N$68  (via drill 0.35)
  Top 0.152: v30.18,41 30.79,41.6 30.79,43.13 R16.1 | v28.96,41 28.96,52.12 30.86,54.03 30.86,57.53 36.5,63.17 v42.6,63.17
  Bottom 0.152: v28.96,41 v30.18,41 | v42.6,63.17 43.51,63.17 43.74,63.4 47.09,63.4 48.62,61.87 J1.4
N$69  (via drill 0.35)
  Top 0.152: v13.95,50.44 10.52,47.02 R11.1 | v30.71,59.36 31.77,59.36 41.68,69.27 59.28,69.27 61.19,67.36 J1.9
  Bottom 0.152: v13.95,50.44 23.16,50.44 27.05,54.33 27.05,55.7 v30.71,59.36
N$70  (via drill 0.35)
  Top 0.152: v30.25,54.33 24.84,48.92 24.84,45.34 25.68,44.5 25.68,43.2 R15.1 | v32.99,57.07 37.41,57.07 47.62,67.28 48.62,67.28 J1.3
  Bottom 0.152: v32.99,57.07 v30.25,54.33
N$71  (via drill 0.35)
  Top 0.152: v55.09,45.87 53.03,43.81 53.03,43.2 R20.2 | v60.43,51.21 60.43,61.04 61.19,61.8 J1.10
  Bottom 0.152: v60.43,51.21 v55.09,45.87
N$72
  Top 0.152: R12.1 10.44,43.2 10.44,45.26 9.6,46.1 9.6,47.85 12.8,51.05 26.36,51.05 29.64,54.33 29.64,56.77 41.83,68.96 51.21,68.96 52.81,67.36 J1.5
N$73  (via drill 0.35)
  Top 0.152: v49.3,50.9 38.02,50.9 34.98,47.85 34.98,46.1 35.81,45.26 35.81,43.2 R17.1
  Bottom 0.152: v49.3,50.9 54.03,50.9 55.4,52.27 55.4,59.28 52.88,61.8 J1.6
N$74  (via drill 0.35)
  Top 0.152: v16.46,45.72 15.62,44.88 15.62,43.2 R13.1
  Bottom 0.152: v16.46,45.72 16.46,47.02 13.34,50.14 13.34,53.26 14.33,54.25 14.33,56.84 19.43,61.95 19.43,63.32 23.39,67.28 44.42,67.28 J1.1
N$75
  Bottom 0.152: R4.2 22.86,21.64 31.93,21.64 32.69,22.4 36.04,22.4 48.23,10.21 P-A.4
N$76  (via drill 0.35)
  Top 0.152: v96.01,35.74 100.43,31.32 110.49,31.32 LED1.A | v77.65,35.74 76.66,35.74 73.99,33.07 R31.1
  Bottom 0.152: v77.65,35.74 v96.01,35.74
N$77  (via drill 0.35)
  Top 0.152: LED2.A 110.49,24.84 v110.64,24.99 | v93.12,29.72 89.31,29.72 89,30.02 v87.86,30.02 | v81.23,31.24 79.7,31.24 76.66,28.19 74.98,28.19 73.99,29.18 R32.1
  Bottom 0.152: v110.64,24.99 110.64,25.91 106.83,29.72 v93.12,29.72 | v87.86,30.02 82.45,30.02 v81.23,31.24
N$78  (via drill 0.35)
  Top 0.152: LED3.A 110.49,17.68 111.48,18.67 v111.48,25.53 | v93.8,30.33 89.53,30.33 88.32,31.55 87.63,31.55 v82.68,26.59 | v73.46,26.75 73.46,25.91 73.91,25.45 R33.1
  Bottom 0.152: v111.48,25.53 106.68,30.33 v93.8,30.33 | v82.68,26.59 73.61,26.59 v73.46,26.75
N$79  (via drill 0.35)
  Top 0.152: v102.41,8.38 110.49,8.38 LED4.A | v77.88,21.34 76.58,22.63 74.98,22.63 73.99,21.64 R34.1
  Bottom 0.152: v102.41,8.38 91.06,8.38 89.92,9.53 89.92,11.35 79.93,21.34 v77.88,21.34
N$80
  Top 0.152: LED5.A 80.01,13.56 78.18,13.56 73.99,17.75 R35.1
N$81  (via drill 0.35)
  Top 0.152: R35.2 75.82,17.83 75.67,17.83 73.53,19.96 70.64,19.96 60.96,29.64 SL3.4 60.96,35.59 60.58,35.97 v60.58,45.72 | v92.73,37.19 92.51,36.96 92.51,35.66 U$1.OUT8
  Bottom 0.152: v92.73,37.19 74.83,37.19 66.29,45.72 v60.58,45.72
N$82
  Bottom 0.152: SL2.2 66.06,17.83 66.52,17.83 70.94,22.25 81.92,22.25 83.82,20.34 P-D.1
N$83  (via drill 0.35)
  Top 0.152: v49.53,41.6 51.05,43.13 R20.1
  Bottom 0.152: v49.53,41.6 18.52,41.6 15.24,38.33 R10.3
N$84  (via drill 0.35)
  Top 0.152: v92.05,34.06 91.82,34.29 91.82,35.59 U$1.OUT7 | v70.94,36.27 v76.2,36.27
  Bottom 0.152: v92.05,34.06 90.98,35.13 77.34,35.13 v76.2,36.27 | v70.94,36.27 69.95,36.27 68.96,37.26 65.23,37.26 63.55,35.59 SL3.3
N$85
  Top 0.152: VREF4095.TP 46.94,16.46 46.94,11.43 45.72,10.21 P-A.3
N$86  (via drill 0.35)
  Top 0.152: v91.14,34.06 91.14,35.59 U$1.OUT6 | v88.01,30.94 87.86,30.94 86.41,29.49 v86.41,23.77
  Bottom 0.152: v88.01,30.94 v91.14,34.06 | P-D.2 86.41,20.34 v86.41,23.77 72.62,37.57 63.4,37.57 62.56,36.73 62.56,34.44 63.09,33.91 63.93,33.91 65.53,35.51 65.99,35.51 SL3.2
N$87
  Top 0.152: INT0.TP 36.8,16.46 36.8,12.72 34.29,10.21 P-B.10
N$88
  Top 0.152: R18.1 41,43.13 41,40.31 45.72,35.59 R7.3
VDD  (via drill 0.35)
  Top 0.4: C2.2 29.49,16.46 29.49,10.44 P-B.8 29.41,10.13 31.93,7.62 59.51,7.62 v59.66,7.85 59.66,5.11 REFVDD.TP 60.73,4.04 77.88,4.04 78.49,4.65 78.49,5.49 | 78.49,5.49 75.89,8.08 75.89,11.43 C4.2 76.05,11.51 80.09,11.51 81.92,13.34 81.92,26.98 84.96,30.02 84.96,31.62 83.97,32.61 C5.1 | C3.2 58.67,16.46 58.67,10.44 58.45,10.21 P-A.8 | INP.8 101.58,10.13 101.58,9.91 97.23,5.56 78.64,5.56 78.49,5.49 | 89.61,61.57 95.86,61.57 SPI_IN.7 100.28,65.99 | 89.61,61.57 84.66,61.57 83.97,62.26 83.97,64.47 82.75,65.68 80.01,65.68 C1.1 | 100.28,65.99 110.49,65.99 SL4.2 | SPI_OUT.7 97.84,72.39 97.84,68.5 100.2,66.14 100.28,65.99 | J1.12 65.46,61.8 67.21,60.05 67.21,53.57 67.59,53.19 67.59,43.2 C10.1 67.59,42.98 67.59,38.79 70.18,36.2 70.18,31.09 74.75,26.52 74.91,26.52 75.82,25.6 R33.2 75.89,25.45 76.5,25.45 83.82,32.77 C5.1 | 86.72,35.59 87.25,35.59 U$1.VCC | 86.72,35.59 83.97,32.84 C5.1 | v84.89,39.24 86.64,37.49 86.64,35.74 86.72,35.59 | 89.61,61.57 89.61,50.6 90.07,50.14 91.67,50.14 92.28,50.75 J2.2
  Bottom 0.4: v59.66,7.85 59.66,8.91 P-A.8 | 84.81,39.7 82.98,39.7 82.07,40.62 80.01,40.62 IC4.3 | 84.81,39.7 90.53,45.41 90.53,49 92.28,50.75 J2.2 | v84.89,39.24 84.89,39.55 84.81,39.7
VSS  (via drill 0.35)
  Top 0.4: 108.89,11.96 107.21,11.96 107.14,12.04 105.99,12.04 104.17,10.21 INP.9 | 108.89,11.96 110.49,11.96 LED4.C | U$1.GND 93.12,27.89 99.06,27.89 IC2.1 | 108.89,19.58 107.37,19.58 106.68,20.27 P-D.10 | 108.89,19.58 109.35,19.58 | 109.35,19.58 110.49,19.58 LED3.C | 109.35,19.58 109.35,24.77 110.49,25.91 LED2.C 110.64,27.28 111.63,28.27 111.63,32.16 110.49,33.3 LED1.C 110.34,34.9 110.34,38.1 97.84,50.6 J2.1 97.77,50.75 94.72,50.75 93.04,49.07 87.33,49.07 87.02,49.38 86.49,49.38 IC3.4 | 108.89,19.58 108.89,11.96 | IC3.4 86.33,49.53 86.11,49.3 86.11,47.02 C7.2 85.88,46.86 85.19,46.18 85.19,46.1 84.96,45.87 80.62,45.87 79.78,46.71 C11.2 79.63,46.94 79.63,46.79 75.48,42.63 | IC4.2 75.48,42.63 | 75.48,42.63 74.98,43.13 69.57,43.13 C10.2 | 53.03,49.68 53.03,50.75 C12.2 | 53.03,49.68 53.03,48.16 | 53.03,48.16 53.03,47.02 R23.2 | 50.06,51.66 50.37,51.97 50.44,51.97 52.2,53.72 52.2,53.8 52.96,54.56 C8.2 | 50.06,51.66 50.06,49.91 50.29,49.68 | 53.03,49.68 50.29,49.68 | 53.03,48.16 57,48.16 57.99,47.17 R22.2 58.06,46.94 58.06,43.2 R21.2 58.06,42.98 58.06,19.2 60.58,16.69 C3.1 | IC6.2 39.4,54.56 39.55,54.56 42.37,51.74 49.91,51.74 50.06,51.66 | 50.29,49.68 50.22,49.53 48.01,47.32 48.01,47.17 R24.2 47.93,46.94 46.86,45.87 43.97,45.87 42.98,46.86 R25.2 42.9,47.02 41.76,48.16 40.16,48.16 39.01,47.02 37.8,47.02 R26.2 37.72,47.17 v36.58,48.31 | OUTP.9 27.89,71.09 27.66,70.87 27.66,66.06 C6.2 27.66,65.84 27.66,64.62 28.96,63.32 28.96,55.63 IC1.9 | R30.2 17.53,47.02 18.75,47.02 19.89,48.16 21.41,48.16 22.55,47.02 R29.2 22.71,47.09 23.55,47.09 v23.93,47.47 | v27.66,50.83 27.66,47.02 R28.2
  Top 0.4: v31.39,48.31 32.69,47.02 R27.2 | C2.1 31.47,16.46 31.47,10.44 P-B.9 31.93,10.06 33.76,8.23 58.98,8.23 60.81,10.06 P-A.9 60.96,10.21 60.66,10.52 60.66,16.46 C3.1 | REFVSS.TP 77.42,5.11 77.42,5.71 73.99,9.14 C4.1 73.84,11.51 68.05,17.3 SL2.1 68.58,17.75 68.28,17.75 66.52,16 60.81,16 C3.1 | 66.94,65.8 65.46,67.28 J1.11 | 66.94,65.8 68.89,63.86 80.01,63.86 C1.2 80.09,63.63 84.89,58.83 84.89,57.15 86.26,55.78 86.26,49.68 IC3.4 | 80.01,19.96 80.01,26.98 83.82,30.79 C5.2 | 80.01,19.96 LED5.C | SL3.1 68.58,35.59 64.47,39.7 64.47,43.13 C9.2 64.54,43.36 65.99,44.81 65.99,54.56 IC5.2 65.99,54.79 63.63,57.15 63.63,62.48 66.94,65.8 | 80.01,19.96 74.14,19.96 73.69,20.42 73.23,20.42 68.58,25.07 SL1.1
  Bottom 0.4: IC2.1 99.06,27.89 106.68,20.27 P-D.10 | 102.18,65.38 105.92,65.38 107.75,63.55 110.49,63.55 SL4.1 | 102.18,65.38 100.36,63.55 SPI_IN.8 100.28,63.32 100.28,57.61 97.84,55.17 97.84,50.83 J2.1 | SPI_OUT.8 100.36,72.39 100.36,67.28 102.11,65.53 102.18,65.38 | v27.66,50.83 27.66,54.33 IC1.9 | v27.66,50.83 27.81,50.75 30.25,48.31 v31.39,48.31 v36.58,48.31 | v23.93,47.47 24.23,47.47 27.51,50.75 v27.66,50.83 | SL3.1 SL1.1 68.5,26.52 64.92,22.94 64.92,16.61 65.53,16 66.52,16 68.28,17.75 68.58,17.75 SL2.1

### Text on the board
Top: POWER | MBMC IO BOARD | FGB@MCHP 1.1